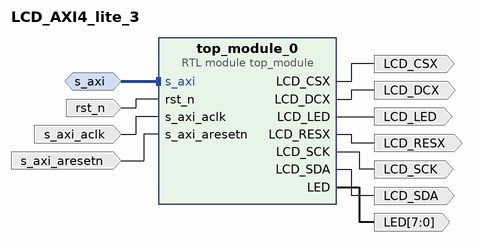
[diagram p0: block diagram of the top level]
# Vivado block design LCD_AXI4_lite_3, xc7z010clg400-1, Vivado 2025.1
create_bd_design LCD_AXI4_lite_3

create_bd_intf_port -mode Slave -vlnv xilinx.com:interface:aximm_rtl:1.0 s_axi
set_property -dict [list \
  CONFIG.ADDR_WIDTH 4 \
  CONFIG.ARUSER_WIDTH 0 \
  CONFIG.AWUSER_WIDTH 0 \
  CONFIG.BUSER_WIDTH 0 \
  CONFIG.CLK_DOMAIN LCD_AXI4_lite_3_s_axi_aclk \
  CONFIG.DATA_WIDTH 32 \
  CONFIG.FREQ_HZ 50000000 \
  CONFIG.HAS_BRESP 1 \
  CONFIG.HAS_BURST 0 \
  CONFIG.HAS_CACHE 0 \
  CONFIG.HAS_LOCK 0 \
  CONFIG.HAS_PROT 1 \
  CONFIG.HAS_QOS 0 \
  CONFIG.HAS_REGION 0 \
  CONFIG.HAS_RRESP 1 \
  CONFIG.HAS_WSTRB 1 \
  CONFIG.ID_WIDTH 0 \
  CONFIG.NUM_READ_OUTSTANDING 1 \
  CONFIG.NUM_READ_THREADS 1 \
  CONFIG.NUM_WRITE_OUTSTANDING 1 \
  CONFIG.NUM_WRITE_THREADS 1 \
  CONFIG.PROTOCOL AXI4LITE \
  CONFIG.READ_WRITE_MODE READ_WRITE \
  CONFIG.RUSER_BITS_PER_BYTE 0 \
  CONFIG.RUSER_WIDTH 0 \
  CONFIG.WUSER_BITS_PER_BYTE 0 \
  CONFIG.WUSER_WIDTH 0 \
] [get_bd_intf_ports s_axi]
create_bd_port -dir O -from 7 -to 0 LED
create_bd_port -dir O LCD_CSX
create_bd_port -dir O LCD_RESX
create_bd_port -dir O LCD_DCX
create_bd_port -dir O LCD_SDA
create_bd_port -dir O LCD_SCK
create_bd_port -dir O LCD_LED
create_bd_port -dir I -type clk s_axi_aclk
set_property -dict {CONFIG.CLK_DOMAIN LCD_AXI4_lite_3_s_axi_aclk CONFIG.FREQ_HZ 50000000} [get_bd_ports s_axi_aclk]
create_bd_port -dir I -type rst s_axi_aresetn
create_bd_port -dir I -type rst rst_n

create_bd_cell -type module -reference top_module top_module_0

# ---- connections ----

connect_bd_intf_net [get_bd_intf_pins top_module_0/s_axi] [get_bd_intf_ports s_axi]
connect_bd_net [get_bd_ports rst_n] [get_bd_pins top_module_0/rst_n]
connect_bd_net [get_bd_ports s_axi_aclk] [get_bd_pins top_module_0/s_axi_aclk]
connect_bd_net [get_bd_ports s_axi_aresetn] [get_bd_pins top_module_0/s_axi_aresetn]
connect_bd_net [get_bd_pins top_module_0/LCD_CSX] [get_bd_ports LCD_CSX]
connect_bd_net [get_bd_pins top_module_0/LCD_DCX] [get_bd_ports LCD_DCX]
connect_bd_net [get_bd_pins top_module_0/LCD_LED] [get_bd_ports LCD_LED]
connect_bd_net [get_bd_pins top_module_0/LCD_RESX] [get_bd_ports LCD_RESX]
connect_bd_net [get_bd_pins top_module_0/LCD_SCK] [get_bd_ports LCD_SCK]
connect_bd_net [get_bd_pins top_module_0/LCD_SDA] [get_bd_ports LCD_SDA]
connect_bd_net [get_bd_pins top_module_0/LED] [get_bd_ports LED]

validate_bd_design
save_bd_design
